# Altium schematic sheet Filter.SchDoc
size 416 x 292 mm; DocumentNumber: 3; SheetNumber: 3; SheetTotal: 3
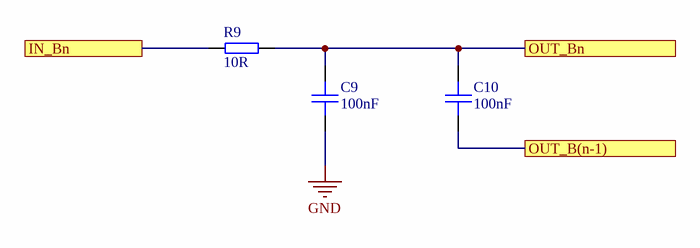
[diagram p0: Filter.SchDoc]

## Parts
C9  100nF  [CAP 0603]
C10  100nF  [CAP 0603]
R9  10R  [0603]

## Ports
IN_Bn, OUT_B(n-1), OUT_Bn

## Nets
GND: C9.1
IN_Bn: R9.1 ; port IN_Bn
OUT_B(n-1): C10.1 ; port OUT_B(n-1)
OUT_Bn: C9.2 C10.2 R9.2 ; port OUT_Bn

## Notes on the sheet
- 1
- 2
- 3
- 4
- 5
- 6
- 7
- 8
- A
- B
- C
- D
- E
- F
- Nr.
- Sheet
- of

## Library data of the parts
C9 C10 = 5: ID: 5; Value: 100nF; Mounting: SMT; Package: 0603
R9 = 219: ID: 219; Tolerance: 1%; Power Rating: 0.1W; Value: 10R; Mounting: SMD; Type: Chip; Package: 0603